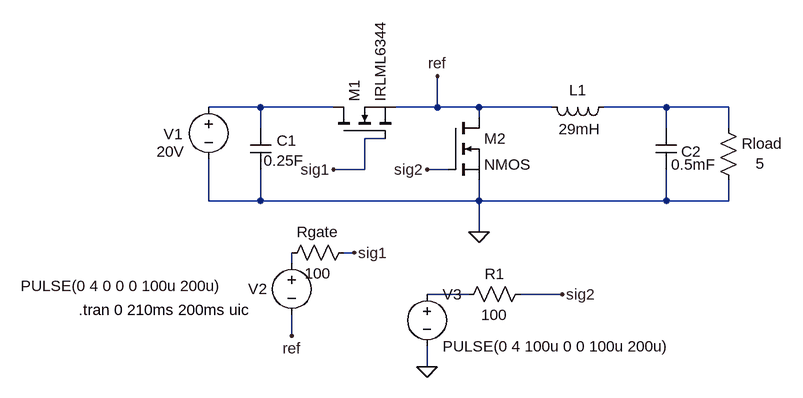
[diagram p0: schematic synchronus buck design.asc]
synchronus buck design.asc, the LTspice schematic file:
Version 4.1
SHEET 1 1620 680
WIRE -592 -96 -672 -96
WIRE -480 -96 -592 -96
WIRE -320 -96 -320 -144
WIRE -320 -96 -384 -96
WIRE -256 -96 -320 -96
WIRE -144 -96 -256 -96
WIRE 32 -96 -64 -96
WIRE 128 -96 32 -96
WIRE -256 -80 -256 -96
WIRE -592 -64 -592 -96
WIRE 32 -64 32 -96
WIRE 128 -64 128 -96
WIRE -400 -48 -432 -48
WIRE -432 0 -432 -48
WIRE -432 0 -480 0
WIRE -304 0 -336 0
WIRE -672 48 -672 -16
WIRE -592 48 -592 0
WIRE -592 48 -672 48
WIRE -256 48 -256 16
WIRE -256 48 -592 48
WIRE 32 48 32 0
WIRE 32 48 -256 48
WIRE 128 48 128 16
WIRE 128 48 32 48
WIRE -256 96 -256 48
WIRE -448 128 -464 128
WIRE -544 144 -544 128
WIRE -272 192 -336 192
WIRE -128 192 -192 192
WIRE -544 256 -544 224
WIRE -336 304 -336 272
FLAG -448 128 sig1
FLAG -480 0 sig1
FLAG -256 96 0
FLAG -320 -144 ref
FLAG -544 256 ref
FLAG -336 0 sig2
FLAG -128 192 sig2
FLAG -336 304 0
SYMBOL voltage -672 -112 R0
WINDOW 0 -69 57 Left 2
WINDOW 3 -80 84 Left 2
WINDOW 123 0 0 Left 0
WINDOW 39 0 0 Left 0
SYMATTR InstName V1
SYMATTR Value 20V
SYMBOL cap 16 -64 R0
WINDOW 0 39 36 Left 2
SYMATTR InstName C2
SYMATTR Value 0.5mF
SYMBOL ind -48 -112 R90
WINDOW 0 5 56 VBottom 2
WINDOW 3 34 53 VTop 2
SYMATTR InstName L1
SYMATTR Value 29mH
SYMBOL res 112 -80 R0
WINDOW 3 58 71 Left 2
SYMATTR Value 5
SYMATTR InstName Rload
SYMBOL voltage -544 128 R0
WINDOW 0 -67 56 Left 2
WINDOW 3 -417 51 Left 2
WINDOW 123 0 0 Left 0
WINDOW 39 0 0 Left 0
SYMATTR InstName V2
SYMATTR Value PULSE(0 4 0 0 0 100u 200u)
SYMBOL cap -608 -64 R0
WINDOW 0 41 19 Left 2
WINDOW 3 21 50 Left 2
SYMATTR InstName C1
SYMATTR Value 0.25F
SYMBOL res -448 112 R90
WINDOW 0 0 56 VBottom 2
WINDOW 3 32 56 VTop 2
SYMATTR InstName Rgate
SYMATTR Value 100
SYMBOL nmos -480 -48 R270
SYMATTR InstName M1
SYMATTR Value IRLML6344
SYMBOL nmos -304 -80 R0
SYMATTR InstName M2
SYMBOL voltage -336 176 R0
WINDOW 123 0 0 Left 0
WINDOW 39 0 0 Left 0
SYMATTR InstName V3
SYMATTR Value PULSE(0 4 100u 0 0 100u 200u)
SYMBOL res -176 176 R90
WINDOW 0 0 56 VBottom 2
WINDOW 3 32 56 VTop 2
SYMATTR InstName R1
SYMATTR Value 100
TEXT -872 216 Left 2 !.tran 0 210ms 200ms uic

The netlist it stands for:
* synchronus buck design.asc
V1 N001 0 20V
C2 N002 0 0.5mF
L1 N002 ref 29mH
Rload N002 0 5
V2 N003 ref PULSE(0 4 0 0 0 100u 200u)
C1 N001 0 0.25F
Rgate sig1 N003 100
M1 N001 sig1 ref ref IRLML6344
M2 ref sig2 0 0 NMOS
V3 N004 0 PULSE(0 4 100u 0 0 100u 200u)
R1 sig2 N004 100
.model NMOS NMOS
.model PMOS PMOS
.lib standard.mos
.tran 0 210ms 200ms uic
.backanno
.end